# Altium schematic sheet Filters.SchDoc
size B; SheetNumber: 6; SheetTotal: 11
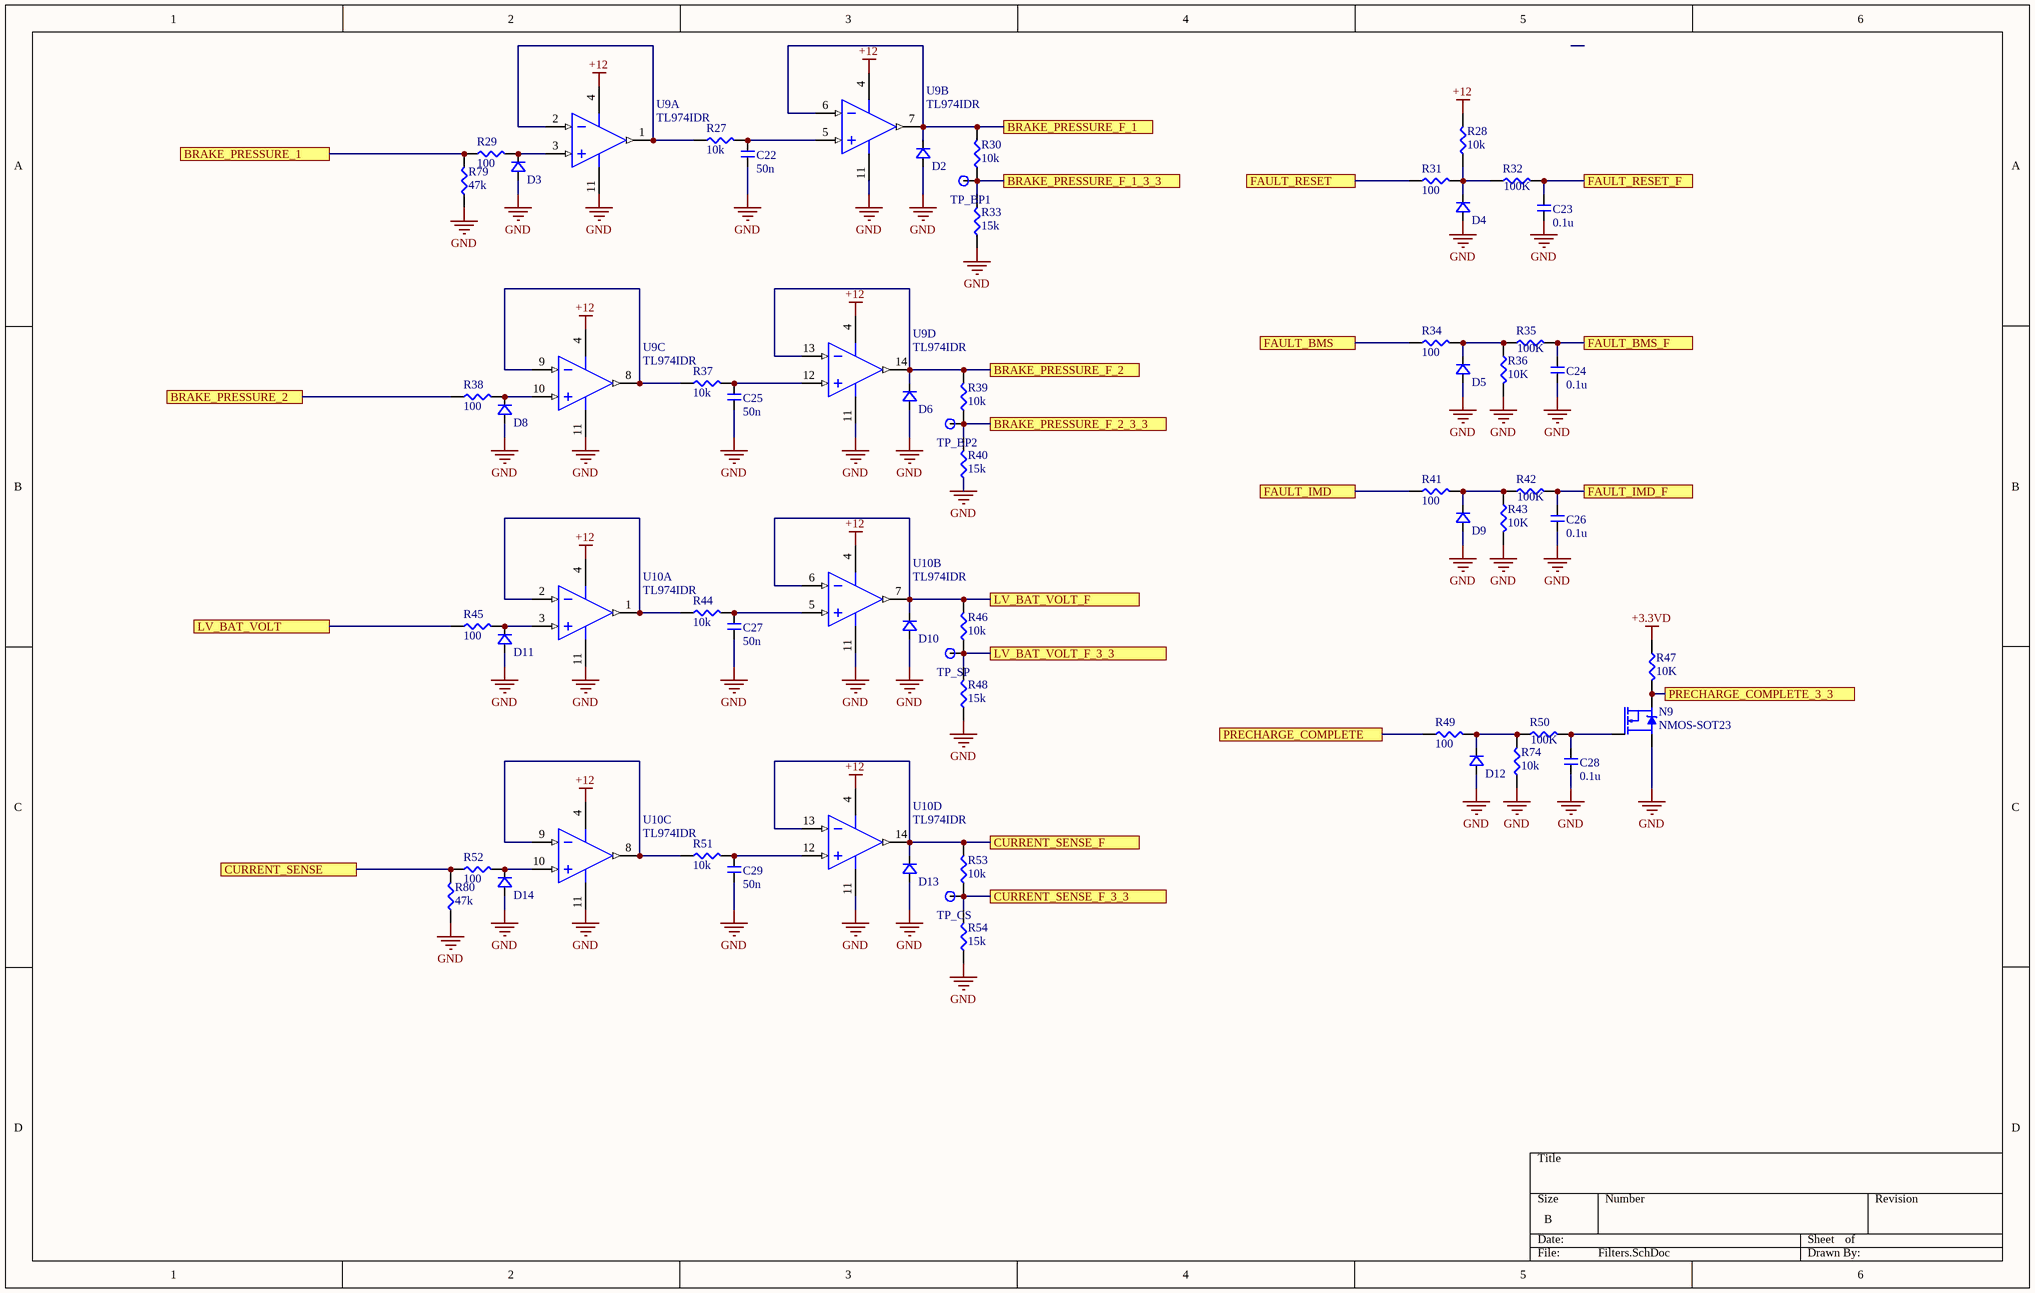
[diagram p0: Filters.SchDoc]

## Parts
C22  50n  [CAP-0603]
C23  0.1u  [CAP-0603]
C24  0.1u  [CAP-0603]
C25  50n  [CAP-0603]
C26  0.1u  [CAP-0603]
C27  50n  [CAP-0603]
C28  0.1u  [CAP-0603]
C29  50n  [CAP-0603]
D2  5V ZENER  [SOD123]  (value not drawn)
D3  12V ZENER  [SOD123]  (value not drawn)
D4  12V ZENER  [SOD123]  (value not drawn)
D5  12V ZENER  [SOD123]  (value not drawn)
D6  5V ZENER  [SOD123]  (value not drawn)
D8  12V ZENER  [SOD123]  (value not drawn)
D9  12V ZENER  [SOD123]  (value not drawn)
D10  5V ZENER  [SOD123]  (value not drawn)
D11  12V ZENER  [SOD123]  (value not drawn)
D12  12V ZENER  [SOD123]  (value not drawn)
D13  5V ZENER  [SOD123]  (value not drawn)
D14  12V ZENER  [SOD123]  (value not drawn)
N9  NMOS-SOT23  [SOT23]
R27  10k  [RES-0603]
R28  10k  [RES-0603]
R29  100  [RES-0603]
R30  10k  [RES-0603]
R31  100  [RES-0603]
R32  100K  [RES-0603]
R33  15k  [RES-0603]
R34  100  [RES-0603]
R35  100K  [RES-0603]
R36  10K  [RES-0603]
R37  10k  [RES-0603]
R38  100  [RES-0603]
R39  10k  [RES-0603]
R40  15k  [RES-0603]
R41  100  [RES-0603]
R42  100K  [RES-0603]
R43  10K  [RES-0603]
R44  10k  [RES-0603]
R45  100  [RES-0603]
R46  10k  [RES-0603]
R47  10K  [RES-0603]
R48  15k  [RES-0603]
R49  100  [RES-0603]
R50  100K  [RES-0603]
R51  10k  [RES-0603]
R52  100  [RES-0603]
R53  10k  [RES-0603]
R54  15k  [RES-0603]
R74  10k  [RES-0603]
R79  47k  [RES-0603]
R80  47k  [RES-0603]
TP_BP1  (no value)  [Testpoint]
TP_BP2  (no value)  [Testpoint]
TP_CS  (no value)  [Testpoint]
TP_SP  (no value)  [Testpoint]
U9  TL974IDR  [D0014A_M]  (parts A,B,C,D of 4)
U10  TL974IDR  [D0014A_M]  (parts A,B,C,D of 4)

## Ports
BRAKE_PRESSURE_1, BRAKE_PRESSURE_2, BRAKE_PRESSURE_F_1, BRAKE_PRESSURE_F_1_3_3, BRAKE_PRESSURE_F_2, BRAKE_PRESSURE_F_2_3_3, CURRENT_SENSE, CURRENT_SENSE_F, CURRENT_SENSE_F_3_3, FAULT_BMS, FAULT_BMS_F, FAULT_IMD, FAULT_IMD_F, FAULT_RESET, FAULT_RESET_F, LV_BAT_VOLT, LV_BAT_VOLT_F, LV_BAT_VOLT_F_3_3, PRECHARGE_COMPLETE, PRECHARGE_COMPLETE_3_3

## Nets
+3.3VD: R47.1
+12: R28.2 U9.4(VCC+) U10.4(VCC+)
GND: C22.1 C23.1 C24.1 C25.1 C26.1 C27.1 C28.1 C29.1 D2.A D3.A D4.A D5.A D6.A D8.A D9.A D10.A D11.A D12.A D13.A D14.A N9.2(S) R33.1 R36.2 R40.1 R43.2 R48.1 R54.1 R74.1 R79.1 R80.1 U9.11(VCC-) U10.11(VCC-)
BRAKE_PRESSURE_1: R29.1 R79.2 ; port BRAKE_PRESSURE_1
BRAKE_PRESSURE_2: R38.1 ; port BRAKE_PRESSURE_2
BRAKE_PRESSURE_F_1: D2.K R30.2 U9.6(IN2-) U9.7(OUT2) ; port BRAKE_PRESSURE_F_1
BRAKE_PRESSURE_F_1_3_3: R30.1 R33.2 TP_BP1.1 ; port BRAKE_PRESSURE_F_1_3_3
BRAKE_PRESSURE_F_2: D6.K R39.2 U9.13(IN4-) U9.14(OUT4) ; port BRAKE_PRESSURE_F_2
BRAKE_PRESSURE_F_2_3_3: R39.1 R40.2 TP_BP2.1 ; port BRAKE_PRESSURE_F_2_3_3
CURRENT_SENSE: R52.1 R80.2 ; port CURRENT_SENSE
CURRENT_SENSE_F: D13.K R53.2 U10.13(IN4-) U10.14(OUT4) ; port CURRENT_SENSE_F
CURRENT_SENSE_F_3_3: R53.1 R54.2 TP_CS.1 ; port CURRENT_SENSE_F_3_3
FAULT_BMS: R34.1 ; port FAULT_BMS
FAULT_BMS_F: C24.2 R35.2 ; port FAULT_BMS_F
FAULT_IMD: R41.1 ; port FAULT_IMD
FAULT_IMD_F: C26.2 R42.2 ; port FAULT_IMD_F
FAULT_RESET: R31.1 ; port FAULT_RESET
FAULT_RESET_F: C23.2 R32.2 ; port FAULT_RESET_F
LV_BAT_VOLT: R45.1 ; port LV_BAT_VOLT
LV_BAT_VOLT_F: D10.K R46.2 U10.6(IN2-) U10.7(OUT2) ; port LV_BAT_VOLT_F
LV_BAT_VOLT_F_3_3: R46.1 R48.2 TP_SP.1 ; port LV_BAT_VOLT_F_3_3
PRECHARGE_COMPLETE: R49.1 ; port PRECHARGE_COMPLETE
PRECHARGE_COMPLETE_3_3: N9.3(D) R47.2 ; port PRECHARGE_COMPLETE_3_3
NetC22_2: C22.2 R27.2 U9.5(IN2+)
NetC25_2: C25.2 R37.2 U9.12(IN4+)
NetC27_2: C27.2 R44.2 U10.5(IN2+)
NetC28_2: C28.2 N9.1(G) R50.2
NetC29_2: C29.2 R51.2 U10.12(IN4+)
NetD3_K: D3.K R29.2 U9.3(IN1+)
NetD4_K: D4.K R28.1 R31.2 R32.1
NetD5_K: D5.K R34.2 R35.1 R36.1
NetD8_K: D8.K R38.2 U9.10(IN3+)
NetD9_K: D9.K R41.2 R42.1 R43.1
NetD11_K: D11.K R45.2 U10.3(IN1+)
NetD12_K: D12.K R49.2 R50.1 R74.2
NetD14_K: D14.K R52.2 U10.10(IN3+)
NetR27_1: R27.1 U9.1(OUT1) U9.2(IN1-)
NetR37_1: R37.1 U9.8(OUT3) U9.9(IN3-)
NetR44_1: R44.1 U10.1(OUT1) U10.2(IN1-)
NetR51_1: R51.1 U10.8(OUT3) U10.9(IN3-)

## Library data of the parts
C22-C29 = CAP-0603
D2-D6 D8-D14 = DIODE-SOD123
R27-R54 R74 R79 R80 = RES-0603
TP_BP1 TP_BP2 TP_CS TP_SP = Testpoint
U9 U10 = CMP-0015-00021-2: Output Rail-To-Rail Very-Low-Noise Operational Amplifier, 2.7 to 12 V, -40 to 125 degC, 14-pin SOIC (D14), Green (RoHS & no Sb/Br); Manufacturer: Texas Instruments; GBW(Typ)(MHz): 12; Vio (25C)(Max)(mV): 4; Offset Drift(Typ)(uV/C): 5; IIB(Max)(pA): 750000; Sub Family: General Purpose Amplifier, Low Supply Voltage Amplifier (<=2.7V); Total Supply Voltage(Min)(+5V is 5, +/-5V is 10): 2.7; Iq per channel(Max)(mA): 2.8; Rating: Catalog; CMRR(Min)(dB): 60; PackageReference: D0014A; DatasheetVersion: SLOS467G; Code_JEDEC: MS-012; PartNumber: TL974IDR; ComponentLink3Description: Package Specification; Number of Channels: 4; Slew Rate(Typ)(V/us): 5; Mounting Technology: Surface Mount; ComponentLink2Description: Datasheet; Eco-Plan: Green (RoHS & no Sb/Br); ComponentLink1Description: Manufacturer URL; ComponentLink2URL: http://www.ti.com/lit/ds/symlink/tl974.pdf; ComponentLink1URL: http://www.ti.com/; Total Supply Voltage(Max)(+5V is 5, +/-5V is 10): 12; PackageDescription: 14-Pin Plastic Small Outline, Body 8.65 x 3.90 mm, Pitch 1.27 mm; PackageVersion: 4040047-5/M, 06/2011; ComponentLink3URL: http://www.ti.com/lit/ml/mpds177g/mpds177g.pdf